# EAGLE design LaserF2431_max232 (EAGLE 5.12)
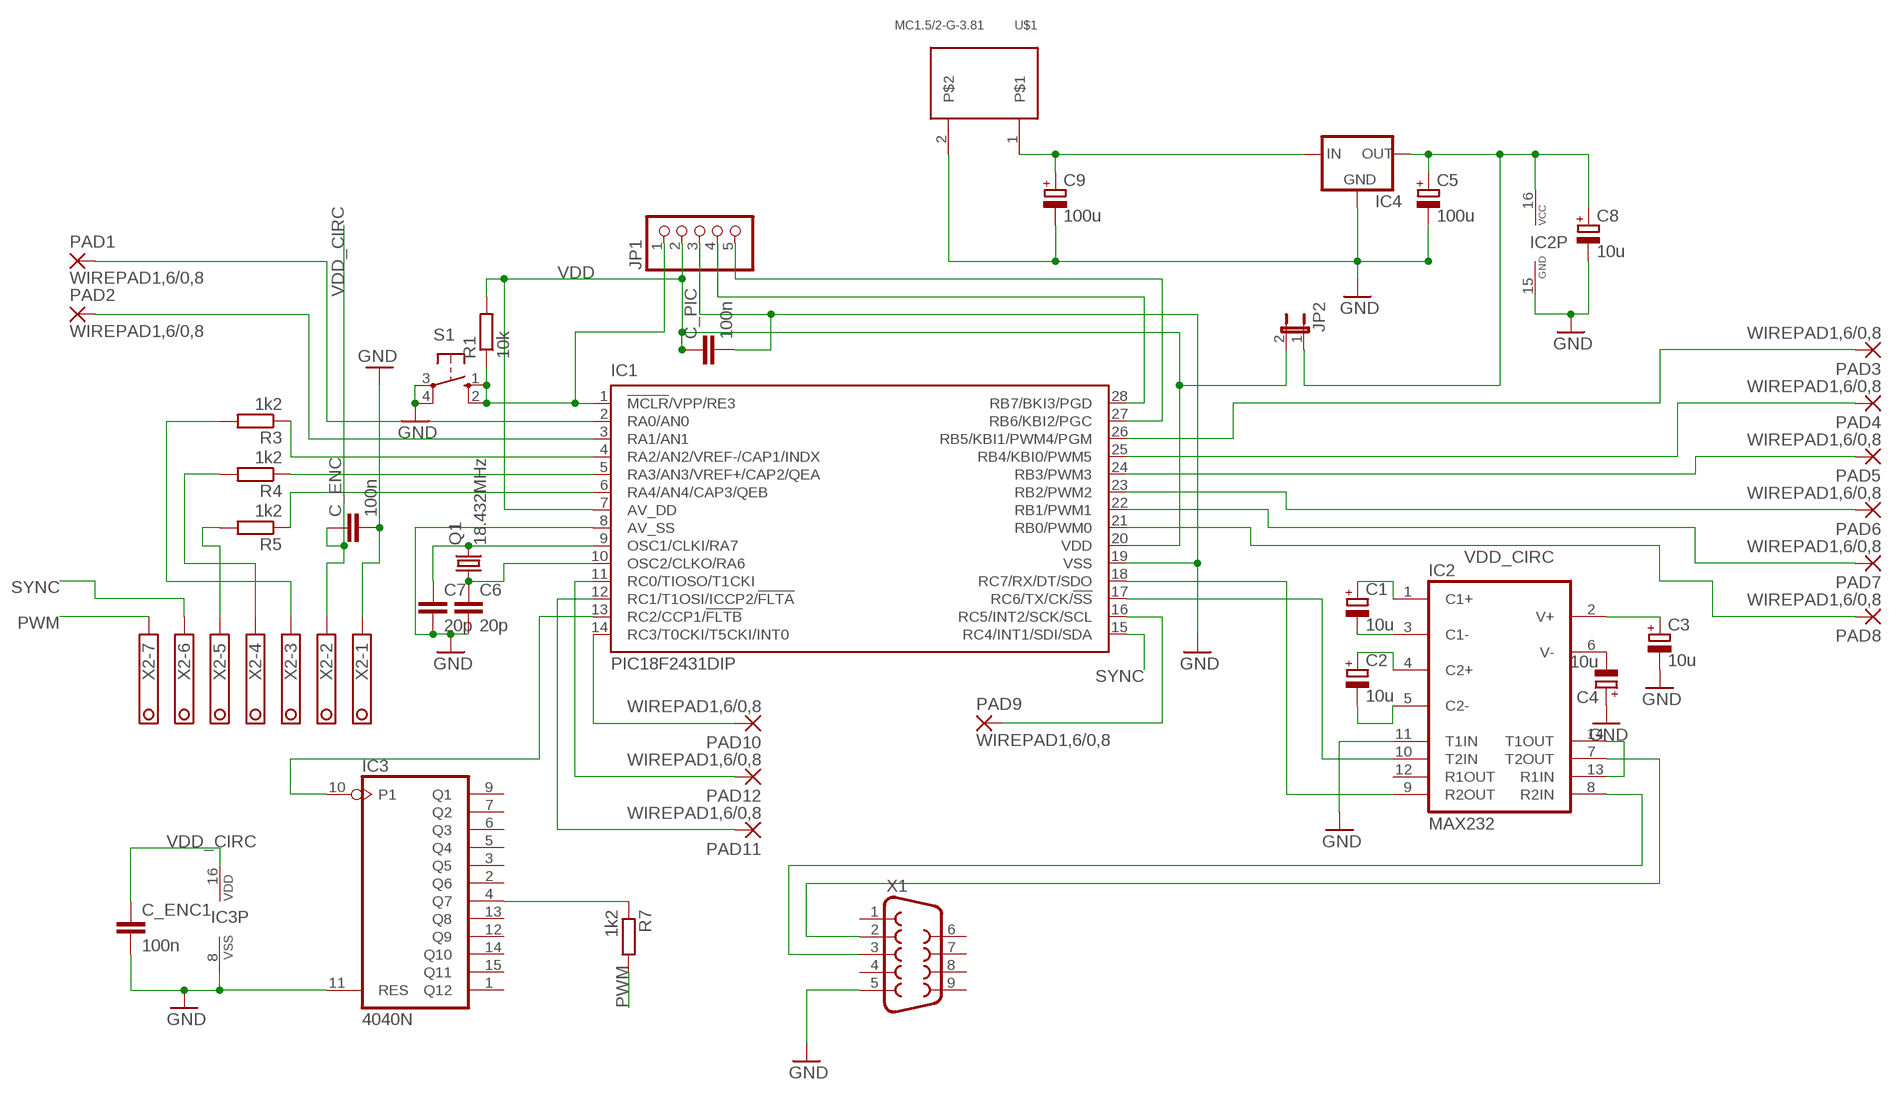
[diagram p0: schematic, sheet 1]

## Parts
C1  10u  CPOL-EUE2.5-6  [E2,5-6]
C2  10u  CPOL-EUE2.5-6  [E2,5-6]
C3  10u  CPOL-EUE2.5-6  [E2,5-6]
C4  10u  CPOL-EUE2.5-6  [E2,5-6]
C5  100u  CPOL-EUE2.5-6  [E2,5-6]
C6  20p  C-EUC0805  [C0805]
C7  20p  C-EUC0805  [C0805]
C8  10u  CPOL-EUE2.5-6  [E2,5-6]
C9  100u  CPOL-EUE2.5-6  [E2,5-6]
C_ENC  100n  C-EUC0805  [C0805]
C_ENC1  100n  C-EUC0805  [C0805]
C_PIC  100n  C-EUC0805  [C0805]
IC1  PIC18F2431DIP  [DIL28-3]
IC2  MAX232  [DIL16]
IC3  4040N  [DIL16]
IC4  78MXXS  [78MXXS]
JP1  PINHD-1X5  [1X05]
JP2  JP1E  [JP1]
PAD1  WIREPAD1,6/0,8  [1,6/0,8]
PAD2  WIREPAD1,6/0,8  [1,6/0,8]
PAD3  WIREPAD1,6/0,8  [1,6/0,8]
PAD4  WIREPAD1,6/0,8  [1,6/0,8]
PAD5  WIREPAD1,6/0,8  [1,6/0,8]
PAD6  WIREPAD1,6/0,8  [1,6/0,8]
PAD7  WIREPAD1,6/0,8  [1,6/0,8]
PAD8  WIREPAD1,6/0,8  [1,6/0,8]
PAD9  WIREPAD1,6/0,8  [1,6/0,8]
PAD10  WIREPAD1,6/0,8  [1,6/0,8]
PAD11  WIREPAD1,6/0,8  [1,6/0,8]
PAD12  WIREPAD1,6/0,8  [1,6/0,8]
Q1  18.432MHz  CRYSTALHC49U-V  [HC49U-V]
R1  10k  R-EU_0204/5  [0204/5]
R3  1k2  R-EU_0204/5  [0204/5]
R4  1k2  R-EU_0204/5  [0204/5]
R5  1k2  R-EU_0204/5  [0204/5]
R7  1k2  R-EU_0204/5  [0204/5]
S1  10-XX  [B3F-10XX]
U$1  MC1.5/2-G-3.81  [MC1.5/2-G-3.81]
X1  F09H  [F09H]
X2  1751293  [1751293]

## Nets
GND: C3.- C4.+ C5.- C6.2 C7.2 C8.- C9.- C_ENC1.2 C_ENC.2 C_PIC.2 IC1.8(AV_SS) IC1.19(VSS) IC2.11(T1IN) IC2.15(GND) IC3.8(VSS) IC3.11(RES) IC4.GND JP1.3 S1.3(P) S1.4(P1) U$1.2 X1.5 X2.1
N$1: IC1.4(RA2/AN2/VREF-/CAP1/INDX) R3.1
N$2: IC1.18(RC7/RX/DT/SDO) IC2.9(R2OUT)
N$3: R5.2 X2.5
N$4: C1.+ IC2.1(C1+)
N$5: IC1.17(RC6/TX/CK/!SS) IC2.10(T2IN)
N$6: C1.- IC2.3(C1-)
N$7: C2.+ IC2.4(C2+)
N$8: C2.- IC2.5(C2-)
N$9: IC2.8(R2IN) X1.3
N$10: C4.- IC2.6(V-)
N$11: C3.+ IC2.2(V+)
N$12: IC1.16(RC5/INT2/SCK/SCL) PAD9.1(P)
N$13: R4.2 X2.4
N$14: R3.2 X2.3
N$15: IC1.5(RA3/AN3/VREF+/CAP2/QEA) R4.1
N$16: IC1.6(RA4/AN4/CAP3/QEB) R5.1
N$17: C7.1 IC1.9(OSC1/CLKI/RA7) Q1.2
N$18: C6.1 IC1.10(OSC2/CLKO/RA6) Q1.1
N$19: IC1.13(RC2/CCP1/!FLTB) IC3.10(P1)
N$20: IC2.13(R1IN) IC2.14(T1OUT)
N$21: IC2.7(T2OUT) X1.2
N$22: IC1.2(RA0/AN0) PAD1.1(P)
N$23: IC1.3(RA1/AN1) PAD2.1(P)
N$24: IC1.26(RB5/KBI1/PWM4/PGM) PAD3.1(P)
N$25: IC1.25(RB4/KBI0/PWM5) PAD4.1(P)
N$26: IC1.24(RB3/PWM3) PAD5.1(P)
N$27: IC1.23(RB2/PWM2) PAD6.1(P)
N$28: IC1.22(RB1/PWM1) PAD7.1(P)
N$29: IC1.21(RB0/PWM0) PAD8.1(P)
N$30: IC1.14(RC3/T0CKI/T5CKI/INT0) PAD10.1(P)
N$33: C9.+ IC4.IN U$1.1
N$34: IC1.11(RC0/TIOSO/T1CKI) PAD12.1(P)
N$35: IC1.12(RC1/T1OSI/ICCP2/!FLTA) PAD11.1(P)
N$41: IC3.4(Q7) R7.1
PGC: IC1.27(RB6/KBI2/PGC) JP1.5
PGD: IC1.28(RB7/BKI3/PGD) JP1.4
PWM: R7.2 X2.7
SYNC: IC1.15(RC4/INT1/SDI/SDA) X2.6
VDD: C_PIC.1 IC1.7(AV_DD) IC1.20(VDD) JP1.2 JP2.2 R1.2
VDD_CIRC: C5.+ C8.+ C_ENC1.1 C_ENC.1 IC2.16(VCC) IC3.16(VDD) IC4.OUT JP2.1 X2.2
VPP: IC1.1(!MCLR!/VPP/RE3) JP1.1 R1.1 S1.1(S) S1.2(S1)
Unconnected: IC2.12(R1OUT) IC3.1(Q12) IC3.2(Q6) IC3.3(Q5) IC3.5(Q4) IC3.6(Q3) IC3.7(Q2) IC3.9(Q1) IC3.12(Q9) IC3.13(Q8) IC3.14(Q10) IC3.15(Q11) X1.1 X1.4 X1.6 X1.7 X1.8 X1.9

## Library data of the parts
C1-C5 C8 C9 = resistor:CPOL-EU: POLARIZED CAPACITOR, European symbol
C6 C7 C_ENC C_ENC1 C_PIC = resistor:C-EU: CAPACITOR, European symbol
IC1 = rpascoal:PIC18F2431: PWM and A/D Microcontrollers with nanoWatt Technology High-Performance, Enhanced Flash, 28/40/44-Pin,
IC2 = maxim:MAX232: RS232 TRANSEIVER; MF: MAXIM; MPN: MAX232ACPE+; OC_FARNELL: 9723773; OC_NEWARK: 68K4544
IC3 = 40xx:4040: 12-stage binary/ripple COUNTER
IC4 = v-reg:78MXXS: VOLTAGE REGULATOR
JP1 = pinhead:PINHD-1X5: PIN HEADER
JP2 = jumper:JP1E: JUMPER
PAD1-PAD12 = wirepad:WIREPAD: Wire PAD connect wire on PCB
Q1 = crystal:CRYSTAL: CRYSTAL; OC_FARNELL: 1666969; OC_NEWARK: unknown
R1 R3-R5 R7 = resistor:R-EU_: RESISTOR, European symbol
S1 = switch-omron:10-XX: OMRON SWITCH; MPN: B3F-1000; OC_FARNELL: 176432; OC_NEWARK: 36M3542
U$1 = rpascoal:MC1.5/2-G-3.81
X1 = con-subd:F09: SUB-D; OC_FARNELL: unknown; OC_NEWARK: unknown
X2 = con-phoenix-350:1751293: MKDS 1/ 7-3,5 Printklemme Nennstrom: 10 A Bemessungsspannung: 160 V Raster: 3,5 mm Polzahl: 7 Montageart: Löten Anschlussart: Schraubanschluss Anschlussrichtung vom Leiter zur Platine: 0° Source: http://eshop.phoenixcontact.com .. 1751293.pdf; OC_FARNELL: unknown; OC_NEWARK: unknown

## Board
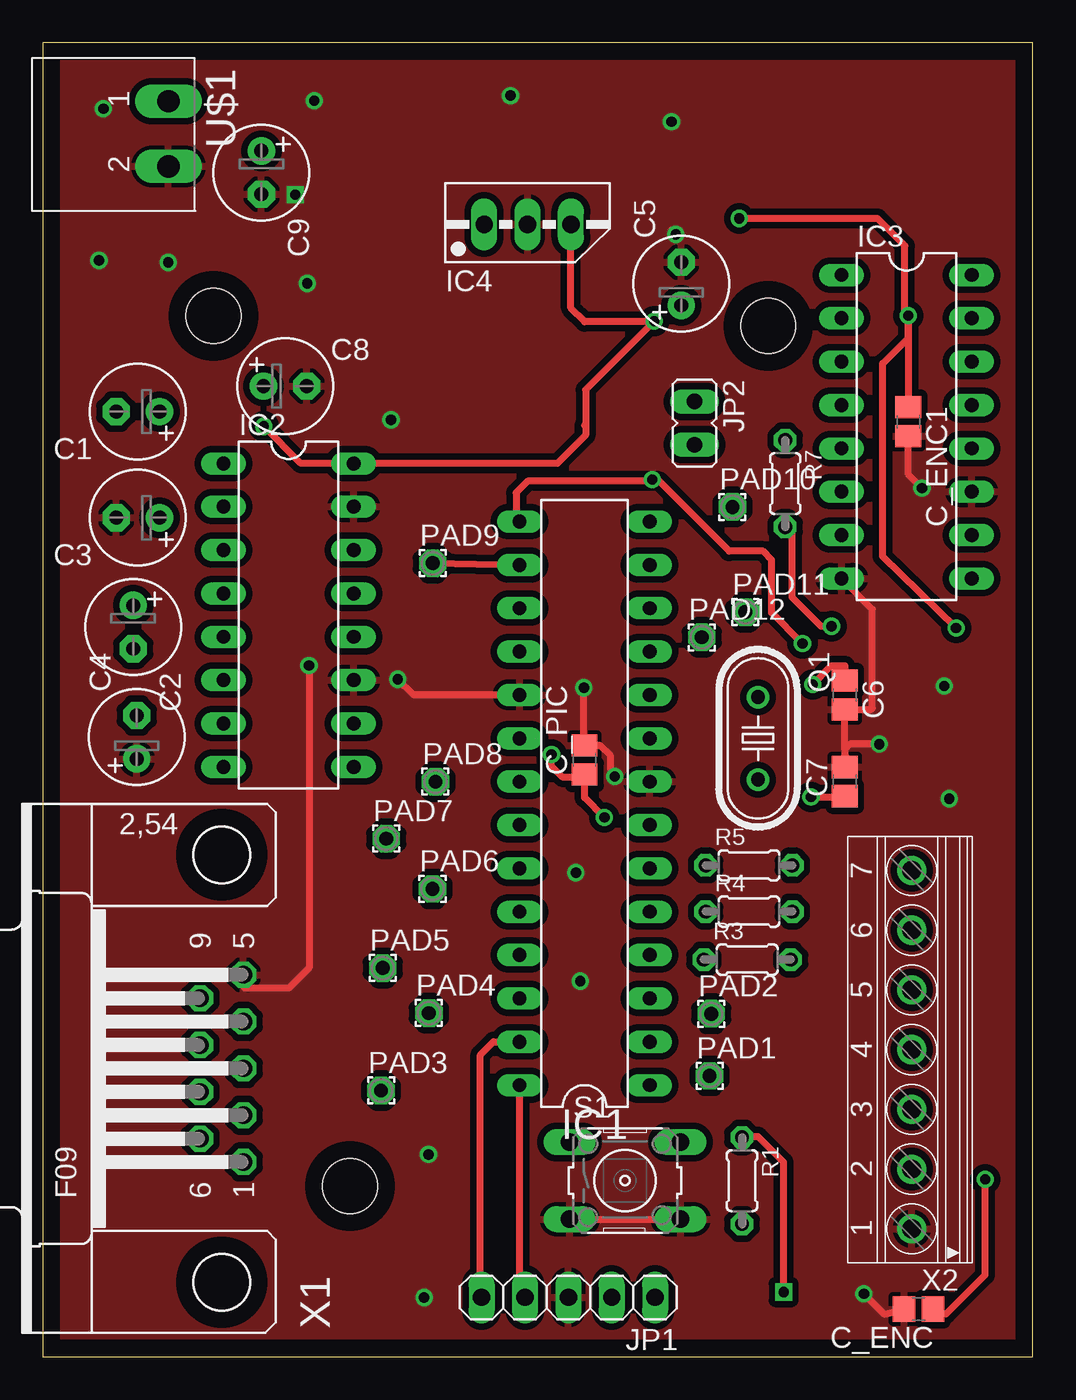
[diagram p1: board, top side]
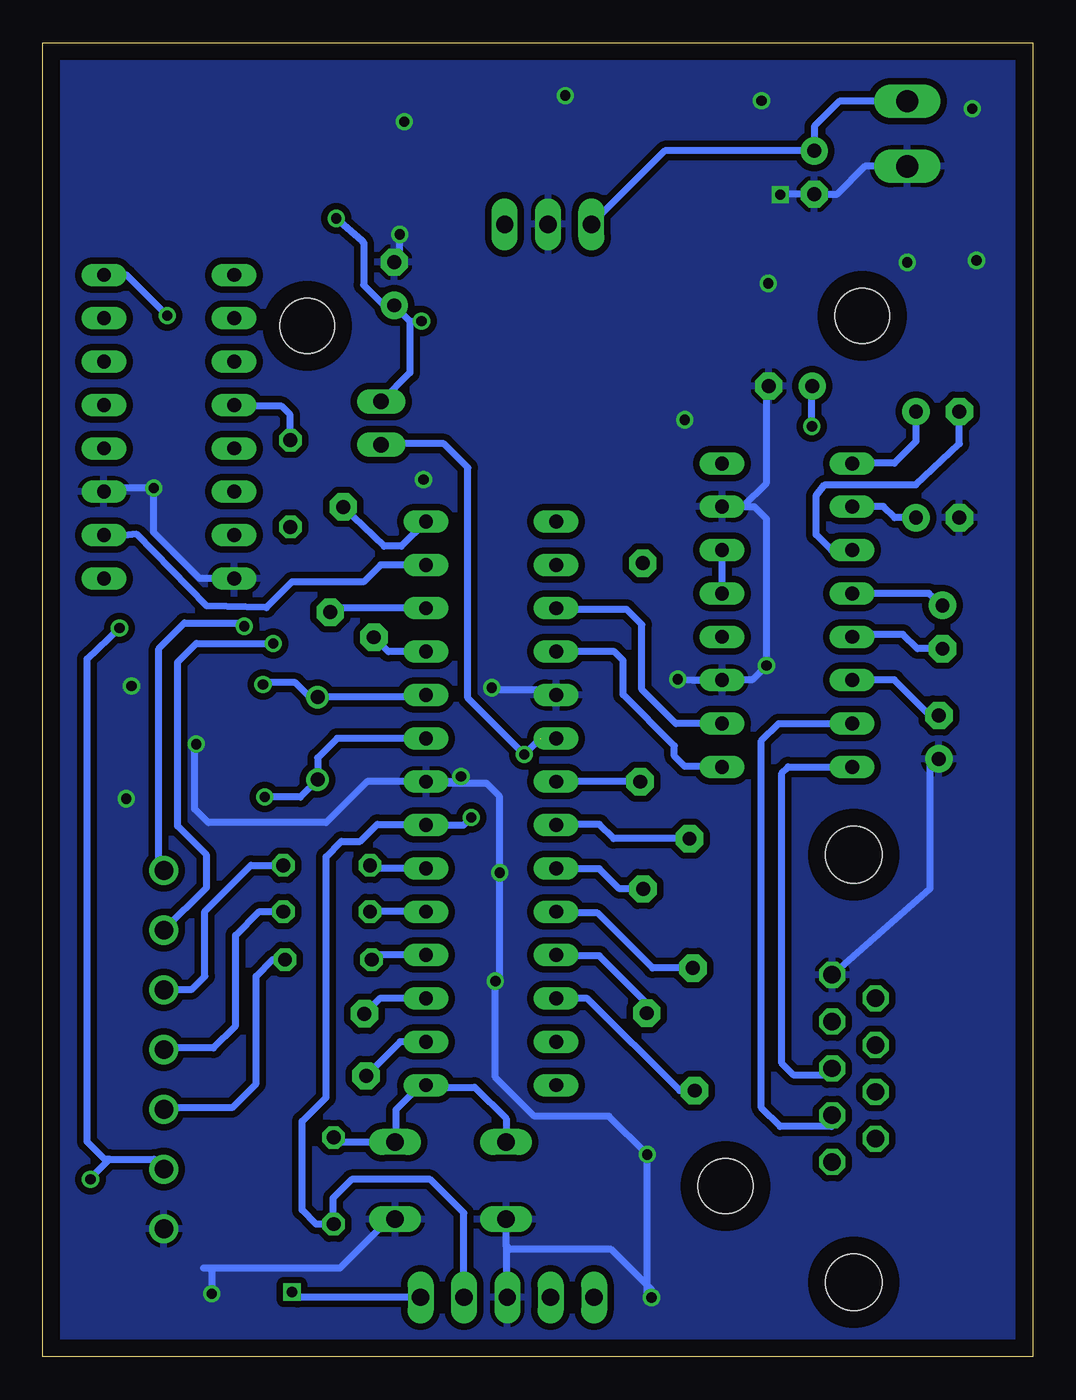
[diagram p2: board, bottom side, seen from below]

Size 58 x 77 mm. Coordinates in mm from the lower left corner, seen from the top.
Outline: 0,0 58,0 58,77 0,77 0,0
Copper layers (1*16): Top 0.035mm / dielectric 1.5mm / Bottom 0.035mm
Design rules "default *": minimum track width 10mil, minimum drill 0.5994mm, track to track 15mil, track to pad 15mil, pad to pad 12mil, via to via 12mil, smd to smd 8mil, copper to edge 40mil, drill to drill 8mil, minimum pad ring 10mil, minimum via ring 8mil, stop-mask expansion 4mil, vias tented up to drill 0mil, thermal gap 10mil
Holes 3.2 mm at 42.5,60.4 10,61 18,10

### Footprints (pad centres in the part's own frame; a part is rotated, then mirrored left to right if it is on the bottom)
E2,5-6 = drill 0.813 pad 1.6 round: + -1.27,0 | drill 0.813 pad 1.6 octagon: - 1.27,0
C0805 = smd 1.3 x 1.5: 1 -0.85,0; 2 0.85,0
DIL28-3 = drill 0.813 long: 1 -16.51,-3.81; 2 -13.97,-3.81; 3 -11.43,-3.81; 4 -8.89,-3.81; 5 -6.35,-3.81; 6 -3.81,-3.81; 7 -1.27,-3.81; 8 1.27,-3.81; 9 3.81,-3.81; 10 6.35,-3.81; 11 8.89,-3.81; 12 11.43,-3.81; 13 13.97,-3.81; 14 16.51,-3.81; 15 16.51,3.81; 16 13.97,3.81; 17 11.43,3.81; 18 8.89,3.81; 19 6.35,3.81; 20 3.81,3.81; 21 1.27,3.81; 22 -1.27,3.81; 23 -3.81,3.81; 24 -6.35,3.81; 25 -8.89,3.81; 26 -11.43,3.81; 27 -13.97,3.81; 28 -16.51,3.81
DIL16 = drill 0.813 long: 1 -8.89,-3.81; 2 -6.35,-3.81; 3 -3.81,-3.81; 4 -1.27,-3.81; 5 1.27,-3.81; 6 3.81,-3.81; 7 6.35,-3.81; 8 8.89,-3.81; 9 8.89,3.81; 10 6.35,3.81; 11 3.81,3.81; 12 1.27,3.81; 13 -1.27,3.81; 14 -3.81,3.81; 15 -6.35,3.81; 16 -8.89,3.81
78MXXS = drill 1.016 long: GND 0,-2.54; IN -2.54,-2.54; OUT 2.54,-2.54
1X05 = drill 1.016 long: 1 -5.08,0; 2 -2.54,0; 3 0,0; 4 2.54,0; 5 5.08,0
JP1 = drill 0.914 long: 1 0,-1.27; 2 0,1.27
1,6/0,8 = drill 0.813 pad 1.6 octagon: 1 0,0
HC49U-V = drill 0.813 round: 1 -2.413,0; 2 2.413,0
0204/5 = drill 0.813 octagon: 1 -2.54,0; 2 2.54,0
B3F-10XX = drill 1.016 long: 1 -3.251,2.261; 2 3.251,2.261; 3 -3.251,-2.261; 4 3.251,-2.261
MC1.5/2-G-3.81 = drill 1.3 long: 1 -3.81,8; 2 0,8
F09H = drill 1.016 octagon: 1 -5.486,-1.27; 2 -2.743,-1.27; 3 0,-1.27; 4 2.743,-1.27; 5 5.486,-1.27; 6 -4.115,1.27; 7 -1.372,1.27; 8 1.372,1.27; 9 4.115,1.27 | hole 3.302: -12.522,0; 12.522,0
1751293 = drill 1.1 pad 1.7 round: 1 -10.5,-0.1; 2 -7,-0.1; 3 -3.5,-0.1; 4 0,-0.1; 5 3.5,-0.1; 6 7,-0.1; 7 10.5,-0.1

### Placement (x,y rotation side)
C1  5.58,55.38 180 top
C2  5.3,42.76 270 top
C3  5.58,49.17 180 top
C4  5.51,36.31 90 top
C5  37.41,62.87 90 top
C6  46.98,38.78 270 top
C7  46.98,33.7 90 top
C8  14.2,56.88 0 top
C9  12.81,69.39 270 top
C_ENC  51.3,2.8 180 top
C_ENC1  50.7,54.8 270 top
C_PIC  31.74,34.97 90 top
IC1  31.74,32.43 90 top
IC2  14.4,43.46 270 top
IC3  50.6,54.5 270 top
IC4  28.4,68.9 0 top
JP1  30.79,3.48 180 top
JP2  38.17,54.71 180 top
PAD1  39.06,16.46 0 top
PAD2  39.16,20.1 0 top
PAD3  19.82,15.6 0 top
PAD4  22.62,20.14 0 top
PAD5  19.92,22.78 0 top
PAD6  22.83,27.42 0 top
PAD7  20.12,30.36 0 top
PAD8  23,33.7 0 top
PAD9  22.85,46.5 0 top
PAD10  40.4,49.8 0 top
PAD11  41.16,43.63 0 top
PAD12  38.6,42.16 0 top
Q1  41.9,36.24 270 top
R1  40.96,10.32 270 top
R3  41.27,23.27 0 top
R4  41.37,26.09 0 top
R5  41.37,28.8 0 top
R7  43.49,51.17 270 top
S1  34.11,10.33 0 top
U$1  -0.64,69.75 270 top
X1  10.49,16.9 90 top
X2  50.8,18 90 top

### Tracks (layer width: path | path; a pad name or v marks a point on that pad's centre or on a via)
GND  (via drill 0.6)
  Top 0.406: C_PIC.2 32.67,35.82 33.26,35.22 33.26,34.46 33.6,34.12 v33.5,34 | 46.98,35.6 46.98,35.22 47.1,35.1 47.1,34.67 C7.2 | 46.98,35.6 C6.2 48.53,37.93 48.6,38 48.6,43.8 IC3.8 | S1.3 S1.4 | IC1.19 21.72,38.78 v20.8,39.7 | C_PIC.2 31.8,35.88 | v49,35.9 47.28,35.9 46.98,35.6 | v31.7,39.2 31.7,35.86 C_PIC.2 | v37.08,65.76 36.83,66.02 | C_ENC.2 49.3,2.5 v48.1,3.7 | C_ENC1.2 50.7,51.7 v51.5,50.9 51.7,50.7 | v15.6,40.5 15.6,22.8 14.4,21.6 11.84,21.6 X1.5
  Bottom 0.406: v37.08,65.76 37.08,64.46 C5.- | C4.+ 6.01,35.04 6.01,27.43 X1.5 | 30.86,6.5 30.86,3.56 JP1.3 | 30.86,6.5 S1.3 | S1.4 37.73,8.07 40.6,5.2 48.2,5.2 | 48.2,5.2 48.59,5.2 | U$1.2 9.85,69.75 11.5,68.1 12.79,68.1 C9.- 14.78,68.12 v14.8,68.1 | C8.- 15.6,56.75 15.6,51.2 16.99,49.81 IC2.15 16.3,49.8 15.6,49.1 v15.6,40.5 16.4,39.7 18.16,39.7 IC2.11 19.95,39.65 v20.8,39.7 | IC1.8 39,33.7 41.4,31.3 48.3,31.3 49.1,32.1 49.1,35.8 v49,35.9 | IC1.8 35.45,33.6 32,33.6 31.23,32.83 v31.23,28.37 31.23,22.27 v31.48,22.02 31.48,16.38 29.2,14.1 24.84,14.1 v22.59,11.86 22.59,3.73 v22.34,3.47 22.34,3.94 24.7,6.3 30.66,6.3 30.86,6.5 | IC1.8 33.9,33.7 v33.5,34 | IC1.19 28.18,38.78 28.5,39.1 31.4,39.1 v31.7,39.2 | v48.1,3.7 48.1,5.1 48.2,5.2 | IC3.11 54.2,50.9 v51.5,50.9 51.5,48.3 48.81,45.61 IC3.8
  other vias: 36.83,72.37 3.56,73.13 3.3,64.24 7.36,64.13 35.7,51.4 52.8,39.3 53.1,32.7 20.4,54.9 15.5,62.9 15.9,73.6 27.4,73.9
  pour Bottom: -1.52,73.23 -1.52,-0.25 59.72,-0.15 59.42,77.93 -1.57,77.83
  pour Top: 60,77.5 -2.54,76.84 -2.54,-0.51 60,0.09
N$1
  Bottom 0.406: IC1.4 38.46,23.54 R3.1
N$2
  Bottom 0.406: IC1.18 24.52,41.32 24,40.8 24,38.8 21,35.8 21,35.2 20.4,34.6 18.24,34.6 IC2.9
N$3
  Bottom 0.406: R5.2 45.8,28.8 48.5,26.1 48.5,22.3 49.3,21.5 X2.5
N$4
  Bottom 0.406: C1.+ 6.85,53.63 8.12,52.36 10.57,52.36 IC2.1
N$5
  Bottom 0.406: IC2.10 20.91,37.11 22.9,39.1 22.9,42.9 23.8,43.8 27.87,43.8 IC1.17
N$6
  Bottom 0.406: IC2.3 11.79,47.27 12.69,48.17 12.69,50.46 12.18,51.09 6.85,51.09 4.31,53.51 C1.-
N$7
  Bottom 0.406: IC2.4 6.1,44.73 C2.+
N$8
  Bottom 0.406: C2.- 6.77,41.49 7.61,42.33 10.45,42.33 IC2.5
N$9
  Bottom 0.406: IC2.8 14.33,34.57 14.7,34.2 14.7,17.2 14,16.5 12.06,16.5 X1.3
N$10
  Bottom 0.406: C4.- 6.04,37.58 8.12,39.66 10.57,39.66 IC2.6
N$11
  Bottom 0.406: C3.+ 8.1,49.17 8.76,49.82 10.57,49.82 IC2.2
N$12
  Top 0.406: PAD9.1 IC1.16
N$13
  Bottom 0.406: R4.2 45.31,26.09 46.7,24.7 46.7,19.4 48,18.1 50.8,18.1 X2.4
N$14
  Bottom 0.406: R3.2 44.52,23.27 45.5,22.3 45.5,16 46.9,14.6 50.8,14.6 X2.3
N$15
  Bottom 0.406: R4.1 IC1.5
N$16
  Bottom 0.406: IC1.6 38.65,28.62 R5.1
N$17  (via drill 0.6)
  Top 0.406: v45,32.8 46.93,32.8 C7.1
  Bottom 0.406: IC1.9 40.76,36.24 41.9,35.1 Q1.2 41.9,33.8 42.9,32.8 v45,32.8
N$18  (via drill 0.6)
  Top 0.406: 46.75,39.4 C6.1 46.98,40.48 47,40.5 46.2,40.5 v45.1,39.4
  Bottom 0.406: IC1.10 35.67,38.65 Q1.1 42.35,38.65 43.2,39.5 45,39.5 v45.1,39.4
N$19
  Bottom 0.406: IC3.10 54.26,48 52.5,48.2 48.4,44 44.9,43.9 43.4,45.4 39.2,45.4 38.2,46.4 IC1.13
N$20
  Bottom 0.406: IC2.13 IC2.14
N$21
  Bottom 0.406: IC2.7 14.89,37.11 15.9,36.1 15.9,14.6 14.8,13.5 11.8,13.5 X1.2
N$22
  Bottom 0.406: IC1.2 37.06,18.46 PAD1.1
N$23
  Bottom 0.406: IC1.3 38.26,21 PAD2.1
N$24
  Bottom 0.406: PAD3.1 20.7,15.6 26.1,21 IC1.26
N$25
  Bottom 0.406: PAD4.1 22.62,20.72 25.4,23.5 27.89,23.5 IC1.25
N$26
  Bottom 0.406: PAD5.1 22.28,22.78 25.5,26 27.85,26 IC1.24
N$27
  Bottom 0.406: PAD6.1 24.22,27.42 25.4,28.6 27.91,28.6 IC1.23
N$28
  Bottom 0.406: PAD7.1 24.56,30.36 25.4,31.2 27.89,31.2 IC1.22
N$29
  Bottom 0.406: PAD8.1 IC1.21
N$30
  Bottom 0.406: PAD10.1 38,47.5 36.99,47.5 IC1.14
N$33
  Bottom 0.406: U$1.1 11.34,73.56 12.8,72.1 12.8,70.67 C9.+ 21.56,70.66 IC4.IN
N$34
  Bottom 0.406: IC1.11 37.76,41.32 PAD12.1
N$35
  Bottom 0.406: IC1.12 41.13,43.86 PAD11.1
N$41
  Bottom 0.406: R7.1 43.5,55.2 44,55.7 46.72,55.7 IC3.4
PGC
  Top 0.406: IC1.27 26.4,18.46 25.64,17.7 25.64,3.55 JP1.5
PGD
  Top 0.406: IC1.28 27.93,3.81 JP1.4
PWM  (via drill 0.6)
  Top 0.406: v46.2,42.8 45.6,42.8 43.9,44.5 43.9,48.22 R7.2
  Bottom 0.406: X2.7 51.2,28.8 51.2,41.5 49.7,43 46.4,43 v46.2,42.8
SYNC  (via drill 0.6)
  Top 0.406: v44.5,41.8 42.7,43.6 42.7,46.7 42.2,47.2 40.2,47.2 36.1,51.3 28.4,51.3 27.73,50.63 27.73,49.14 IC1.15
  Bottom 0.406: v44.5,41.8 49,41.8 50.1,40.7 50.1,31.1 48.4,29.4 48.4,27.5 X2.6
VDD  (via drill 0.6)  (1 unrouted)
  Top 0.406: v29.8,35.3 29.8,34.62 30.47,33.95 31.57,33.95 C_PIC.1 31.74,32.76 v32.9,31.6
  Bottom 0.406: JP1.2 33.33,8.43 35.3,10.4 39.9,10.4 41,9.3 41,7.82 R1.2 41.98,7.78 42.8,8.6 42.8,13.8 41.4,15.2 41.4,29.3 40.5,30.2 39.4,30.2 38.4,31.2 35.59,31.2 IC1.7 33.34,31.16 v32.9,31.6 | 28.84,36.24 28.18,36.24 | JP2.2 38.11,53.5 34.5,53.5 33.1,52.1 33.1,38.6 v29.8,35.3 28.86,36.24 IC1.20
VDD_CIRC  (via drill 0.6)
  Top 0.406: v12.95,54.52 15.12,52.35 IC2.16 30.15,52.35 31.8,54 31.8,54.53 | 31.8,54.53 31.75,54.58 | C_ENC.1 52.9,2.5 55.2,4.8 v55.2,10.4 | v50.7,61 C_ENC1.1 | v40.8,66.7 48.9,66.7 50.5,65.1 50.5,61.2 v50.7,61 | v53.5,42.7 49.2,46.9 49.2,58.2 50.7,59.7 v50.7,61 | IC4.OUT 30.94,61.45 31.75,60.64 35.77,60.64 v35.81,60.68 31.8,56.67 31.8,54.53
  Bottom 0.406: 36.49,60.68 v35.81,60.68 | 36.49,60.68 C5.+ 38,61.6 39.2,62.8 39.2,65.3 39.3,65.4 v40.8,66.7 | 36.49,60.68 36.49,57.67 JP2.1 | v12.95,54.52 12.95,56.86 C8.+ | 54.1,11.57 54.37,11.57 55.4,12.6 55.4,40.9 v53.5,42.7 | v55.2,10.4 55.2,10.47 54.1,11.57 | IC3.16 53.09,63.39 v50.7,61 | 54.1,11.57 51.47,11.57 X2.2
VPP  (via drill 0.6)
  Top 0.406: v43.4,3.8 43.4,11.4 41.9,12.9 41,12.9 R1.1
  Bottom 0.406: S1.1 30.86,13.96 32.7,15.8 35.43,15.8 IC1.1 35.88,15.92 37.3,14.5 37.3,12.65 S1.2 40.69,12.59 R1.1 | JP1.1 43.09,3.48 v43.4,3.8